# EAGLE design FDL-3 CTRL - v1.4 (EAGLE 9.1.0)
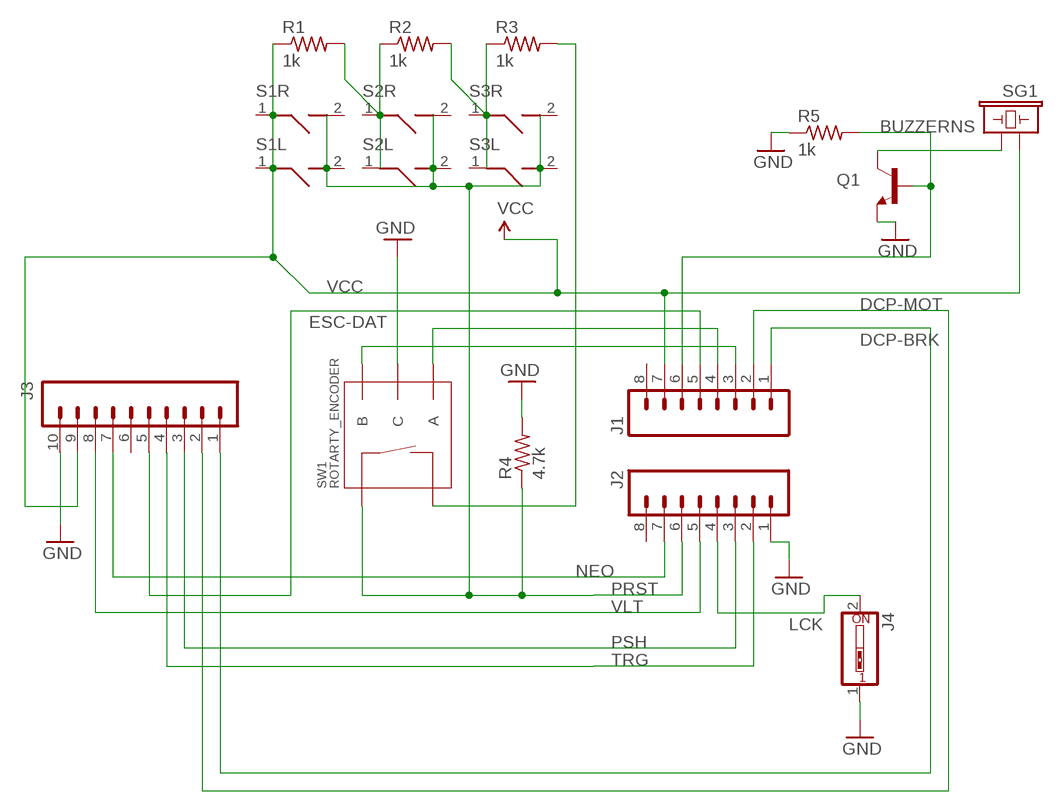
[diagram p0: schematic, sheet 1]

## Parts
J1  M08SILK_FEMALE_PTH  [1X08]
J2  M08SILK_FEMALE_PTH  [1X08]
J3  M10SILK_FEMALE_PTH  [1X10]
J4  SW_DIP-1  [EDG-01]
Q1  TRANSISTOR_NPNBC547  [TO-92-AMMO]
R1  1k  R-US_0204/5  [0204/5]
R2  1k  R-US_0204/5  [0204/5]
R3  1k  R-US_0204/5  [0204/5]
R4  4.7k  R-US_0204/5  [0204/5]
R5  1k  R-US_0204/5  [0204/5]
S1L  RGTANGTCTBTN  [RGTANGTCTBTN]
S1R  RGTANGTCTBTN  [RGTANGTCTBTN]
S2L  RGTANGTCTBTN  [RGTANGTCTBTN]
S2R  RGTANGTCTBTN  [RGTANGTCTBTN]
S3L  RGTANGTCTBTN  [RGTANGTCTBTN]
S3R  RGTANGTCTBTN  [RGTANGTCTBTN]
SG1  BUZZERNS  [BUZZER-12MM-NS]
SW1  ROTARTY_ENCODER  [ROTARY_ENC_PLAIN]

## Nets
DCP-BRK: J1.1 J3.1
DCP-MOT: J1.2 J3.2
ESC-DAT: J1.5 J3.5
GND: J2.1 J3.10 J4.1 Q1.3(E) R4.2 R5.1 SW1.C
LCK: J2.4 J4.2
N$1: R1.2 R2.1 S2L.1 S2R.1
N$2: R2.2 R3.1 S3L.1 S3R.1
N$3: R3.2 SW1.SW-
N$4: Q1.1(C) SG1.-
N$8: J1.4 SW1.A
N$9: J1.3 SW1.B
N$14: J1.6 Q1.2(B) R5.2
NEO: J2.7 J3.7
PRST: J2.6 R4.1 S1L.2 S1R.2 S2L.2 S2R.2 S3L.2 S3R.2 SW1.SW+
PSH: J2.3 J3.3
TRG: J2.2 J3.4
VCC: J1.7 J3.9 R1.1 S1L.1 S1R.1 SG1.+
VLT: J2.5 J3.8
Unconnected: J1.8 J2.8 J3.6

## Library data of the parts
J1 J2 = SparkFun-Connectors:M08: Header 8 Standard 8-pin 0.1" header. Use with straight break away headers (SKU : PRT-00116), right angle break away headers (PRT-00553), swiss pins (PRT-00743), machine pins (PRT-00117), and female headers (PRT-00115).; PROD_ID: CONN-08438
J3 = SparkFun-Connectors:M10: Header 10 Standard 10-pin 0.1" header. Use with straight break away headers (SKU : PRT-00116), right angle break away headers (PRT-00553), swiss pins (PRT-00743), machine pins (PRT-00117), and female headers (PRT-00115).; PROD_ID: CONN-11563
J4 = special:SW_DIP-1: DIP SWITCH
Q1 = SparkFun-DiscreteSemi:TRANSISTOR_NPN: Generic NPN BJT MMBT2222A - TRANS-08049 (SOT-23, 1A 40V) MPSA42 - TRANS-09116 (SOT-23, 500mA 300V) MMBT5088LT1G - TRANS-11160 (SOT-23, 50 mA 30V) BC547 - COM-08928 <http://www.sparkfun.com/products/8928> (TO-92 45V 100mA) (1.Collector 2.Base 3.Emitter) 2N3904 - COM-00521 <http://www.sparkfun.com/products/521> (TO-92 40V 200mA) (1.Emitter 2.Base 3.Collector) P2N2222A - COM-12852 <http://www.sparkfun.com/products/12852> (TO-92 40V 600mA) (1.Collector 2.Base 3.Emitter)
R1-R5 = resistor:R-US_: RESISTOR, American symbol
S1L S1R S2L S2R S3L S3R = RghtAngTactBtn:RGTANGTCTBTN
SG1 = SparkFun-Electromechanical:BUZZER: Buzzer 12mm Spark Fun Electronics SKU : Comp-Buzzer
SW1 = Encoder:ROTARTY_ENCODER: Simple no LED rotary encoder Example: COM-09117

## Board
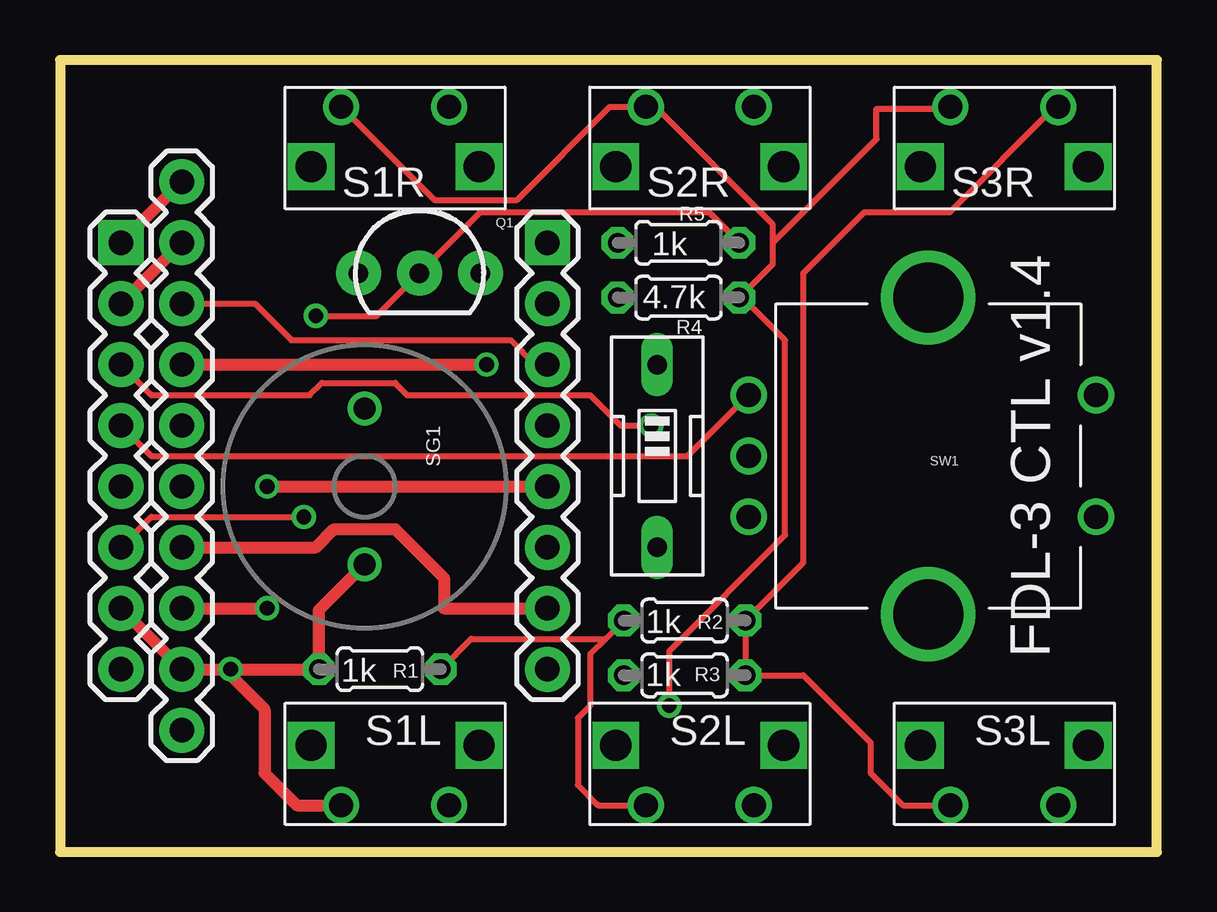
[diagram p1: board, top side]
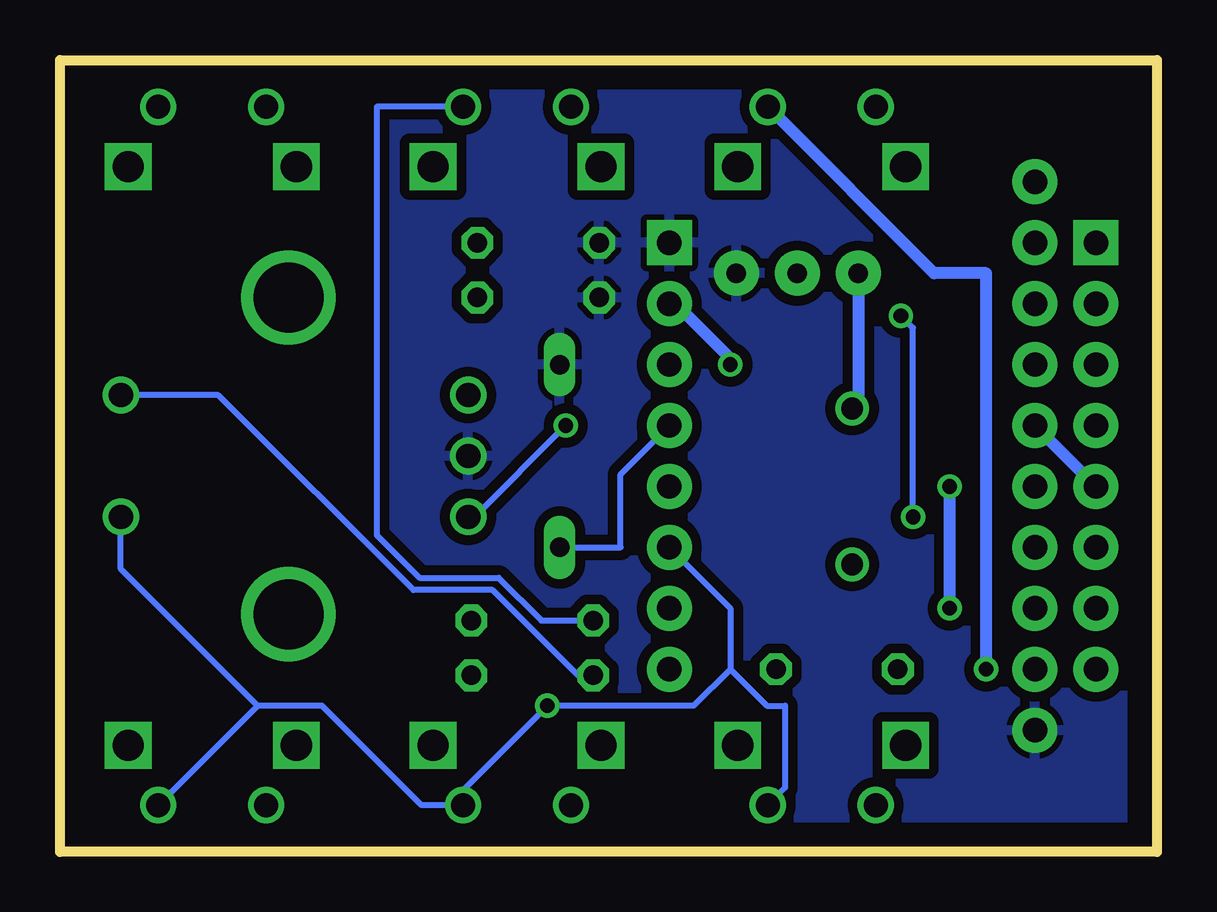
[diagram p2: board, bottom side, seen from below]

Size 45.72 x 33.02 mm. Coordinates in mm from the lower left corner, seen from the top.
Outline: 0,0 45.72,0 45.72,33.02 0,33.02 0,0
Copper layers (1*16): Top 0.035mm / dielectric 1.5mm / Bottom 0.035mm
Design rules "default": minimum track width 10mil, minimum drill 24mil, track to track 8mil, track to pad 8mil, pad to pad 8mil, via to via 8mil, smd to smd 8mil, copper to edge 40mil, drill to drill 8mil, minimum pad ring 10mil, minimum via ring 8mil, stop-mask expansion 4mil, vias tented up to drill 0mil, thermal gap 10mil

### Footprints (pad centres in the part's own frame; a part is rotated, then mirrored left to right if it is on the bottom)
1X08 = drill 1.016 pad 1.88 square: 1 0,0 | drill 1.016 pad 1.88: 2 2.54,0; 3 5.08,0; 4 7.62,0; 5 10.16,0; 6 12.7,0; 7 15.24,0; 8 17.78,0
1X10 = drill 1.016 pad 1.88: 1 0,0; 2 2.54,0; 3 5.08,0; 4 7.62,0; 5 10.16,0; 6 12.7,0; 7 15.24,0; 8 17.78,0; 9 20.32,0; 10 22.86,0
EDG-01 = drill 0.813 long: 1 0,-3.81; 2 0,3.81
TO-92-AMMO = drill 0.813 pad 1.88: 1 -2.54,0; 2 0,0; 3 2.54,0
0204/5 = drill 0.813 octagon: 1 -2.54,0; 2 2.54,0
RGTANGTCTBTN = drill 1: 1 -2.25,-2.49; 2 2.25,-2.49 | drill 1.3 square: 3 -3.501,0; 4 3.501,0
BUZZER-12MM-NS = drill 0.9: + 3.25,0; - -3.25,0
ROTARY_ENC_PLAIN = drill 1.016: A 7.493,-2.54; B 7.493,2.54; C 7.493,0; SW+ -6.985,2.54; SW- -6.985,-2.54 | drill 2.921: P$3 0,6.604; P$4 0,-6.604

### Placement (x,y rotation side)
J1  2.54,25.4 270 top
J2  20.32,25.4 270 top
J3  5.08,27.94 270 top
J4  24.89,16.51 180 top
Q1  14.99,24.13 0 top
R1  13.34,7.62 0 top
R2  26.04,9.65 0 top
R3  26.04,7.37 180 top
R4  25.78,23.11 180 top
R5  25.78,25.4 0 top
S1L  13.97,4.45 0 top
S1R  13.97,28.57 180 top
S2L  26.67,4.45 0 top
S2R  26.67,28.57 180 top
S3L  39.37,4.45 0 top
S3R  39.37,28.57 180 top
SG1  12.7,15.24 270 top
SW1  36.2,16.51 180 top

### Tracks (layer width: path | path; a pad name or v marks a point on that pad's centre or on a via)
DCP-BRK
  Top 0.508: J1.1 J3.1
DCP-MOT
  Top 0.508: J1.2 J3.2
ESC-DAT
  Bottom 0.508: J1.5 J3.5
GND
  pour Bottom (isolate 0.406): 0,0 45.72,0 45.72,33.02 0,33.02
LCK
  Bottom 0.254: J4.2 22.35,12.7 22.35,15.75 J2.4
N$1
  Top 0.254: R1.2 17.14,8.89 22.73,8.89 | 22.73,8.89 R2.1 | 22.73,8.89 22.1,8.26 22.1,6.1 21.59,5.59 21.59,2.79 22.43,1.96 S2L.1
  Bottom 0.254: S2R.1 32.51,31.07 32.51,13.21 30.73,11.43 27.43,11.43 25.65,9.65 R2.1
N$2
  Top 0.254: S3L.1 35.13,1.96 33.78,3.3 33.78,4.57 30.99,7.37 R3.1 R2.2 30.99,12.06 30.99,24.13 33.53,26.67 37.08,26.67 41.48,31.07 S3R.1
N$3
  Bottom 0.254: R3.2 24.13,7.37 27.69,10.92 30.99,10.92 39.12,19.05 SW1.SW-
N$4
  Bottom 0.508: Q1.1 12.45,18.74 SG1.-
N$8
  Top 0.254: J1.4 3.81,16.51 26.16,16.51 SW1.A
N$9  (via drill 0.61)
  Top 0.254: J1.3 3.81,19.05 10.41,19.05 10.92,19.56 13.97,19.56 14.48,19.05 22.1,19.05 23.37,17.78 v24.64,17.78
  Bottom 0.254: v24.64,17.78 28.45,13.97 SW1.B
N$14  (via drill 0.61)
  Top 0.254: J1.6 3.81,13.97 v10.16,13.97 | v10.67,22.35 13.21,22.35 Q1.2 17.53,26.67 27.05,26.67 R5.2
  Bottom 0.254: v10.16,13.97 10.16,21.84 v10.67,22.35
NEO
  Top 0.508: J3.7 10.67,12.7 11.43,13.46 13.97,13.46 16,11.43 16,10.16 J2.7
PRST  (via drill 0.61)
  Top 0.254: S1R.2 15.61,27.18 19.05,27.18 22.94,31.07 S2R.2 24.82,31.07 29.72,26.16 29.72,25.4 | R4.1 28.38,23.18 | 28.38,23.18 29.72,24.51 29.72,25.4 | 29.72,25.4 34.04,29.72 34.04,30.99 37.04,30.99 S3R.2 | v25.4,6.1 25.4,8.38 30.23,13.21 30.23,21.34 28.38,23.18
  Bottom 0.254: J2.6 17.78,10.16 17.78,7.62 | 17.78,7.62 16.26,6.1 15.49,6.1 15.49,2.68 S1L.2 | 17.78,7.62 19.3,6.1 v25.4,6.1 28.92,2.58 S2L.2 30.66,1.96 34.8,6.1 37.48,6.1 | 37.48,6.1 S3L.2 | 37.48,6.1 43.18,11.8 SW1.SW+
PSH
  Top 0.254: J3.3 8.13,22.86 9.65,21.34 18.8,21.34 19.81,20.32 J2.3
TRG  (via drill 0.61)
  Top 0.508: J3.4 v17.78,20.32
  Bottom 0.508: v17.78,20.32 17.78,20.57 20.07,22.86 J2.2
VCC  (via drill 0.61)
  Top 0.508: J1.7 J3.9 | J3.9 v7.11,7.62 R1.1 10.79,10.09 SG1.+ | S1L.1 9.86,1.96 8.53,3.28 8.53,5.95 6.86,7.62 J3.9
  Bottom 0.508: v7.11,7.62 7.11,24.13 9.29,24.13 S1R.1
VLT  (via drill 0.61)
  Top 0.508: J3.8 v8.64,10.16 | v8.64,15.24 J2.5
  Bottom 0.508: v8.64,10.16 v8.64,15.24

### Text on the board
tNames: FDL-3 CTL v1.4